# Altium project Energy Harvesting.PrjPcb
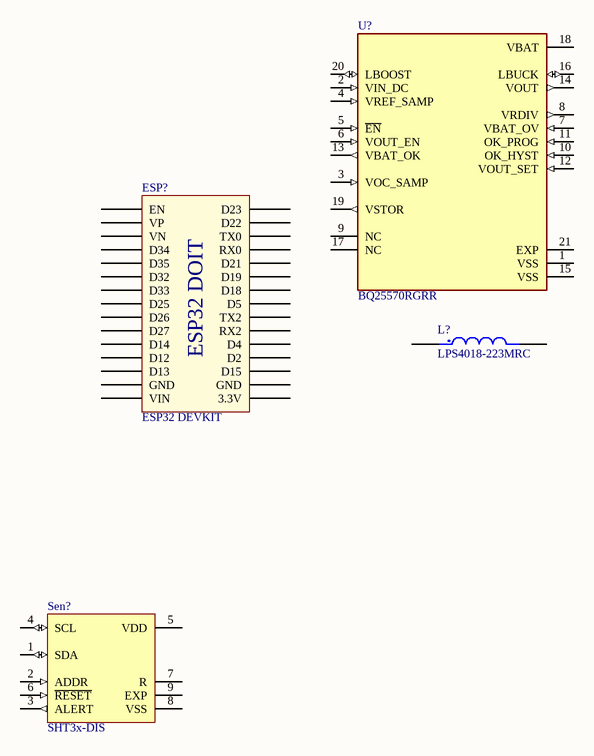
[diagram p0: Schematic.SchDoc]
1 sheet, 4 parts. Net scope: global (net labels, ports and power ports of the same name join across sheets).

## Sheet Schematic.SchDoc
size A; SheetNumber: 1; SheetTotal: 1

### Parts
ESP?  ESP32 DEVKIT  [ESP32 WROOM 32 KIT]
L?  LPS4018-223MRC  [IND_LPS4018-223MRC]
Sen?  SHT3x-DIS
U?  BQ25570RGRR  [QFN50P350X350X100-21N]

### Nets

Not connected (* = marked no-connect by the designer): ESP? 1(EN) 2(VP) 3(VN) 4(D34) 5(D35) 6(D32) 7(D33) 8(D25) 9(D26) 10(D27) 11(D14) 12(D12) 13(D13) 14(GND) 15(VIN) 16(3.3V) 17(GND) 18(D15) 19(D2) 20(D4) 21(RX2) 22(TX2) 23(D5) 24(D18) 25(D19) 26(D21) 27(RX0) 28(TX0) 29(D22) 30(D23); L? 1 2; Sen? 1(SDA) 2(ADDR) 3(ALERT) 4(SCL) 5(VDD) 6(~{RESET}) 7(R) 8(VSS) 9(EXP); U? 1(VSS) 2(VIN_DC) 3(VOC_SAMP) 4(VREF_SAMP) 5(~{EN}) 6(VOUT_EN) 7(VBAT_OV) 8(VRDIV) 9(NC) 10(OK_HYST) 11(OK_PROG) 12(VOUT_SET) 13(VBAT_OK) 14(VOUT) 15(VSS) 16(LBUCK) 17(NC) 18(VBAT) 19(VSTOR) 20(LBOOST) 21(EXP)

### Notes on the sheet
- (in symbol ESP32 WROOM 32 KIT) ESP32 DOIT

### Library data of the parts
ESP? = ESP32 WROOM 32 KIT
L? = LPS4018-223MRC: 22 ÂµH Shielded Drum Core Inductor 650 mA 360mOhm Max Nonstandard; MF: Coilcraft; SnapEDA_Link: https://www.snapeda.com/parts/LPS4018-223MRC/Coilcraft/view-part/?ref=snap; Package: None; Value: *; MP: LPS4018-223MRC; Check_prices: https://www.snapeda.com/parts/LPS4018-223MRC/Coilcraft/view-part/?ref=eda
U? = BQ25570RGRR: Ultra Low power Harvester power Management IC with boost charger, and Nanopower Buck Converter; MF: Texas Instruments; Package: VQFN-20 Texas Instruments; Value: *; Purchase-URL: https://pricing.snapeda.com/search/part/BQ25570RGRR/?ref=eda; Availability: In Stock; MP: BQ25570RGRR; Check_prices: https://www.snapeda.com/parts/BQ25570RGRR/Texas+Instruments/view-part/?ref=eda; SnapEDA_Link: https://www.snapeda.com/parts/BQ25570RGRR/Texas+Instruments/view-part/?ref=snap; Price: None